# EAGLE design Microcontroller_board (EAGLE 5.11)
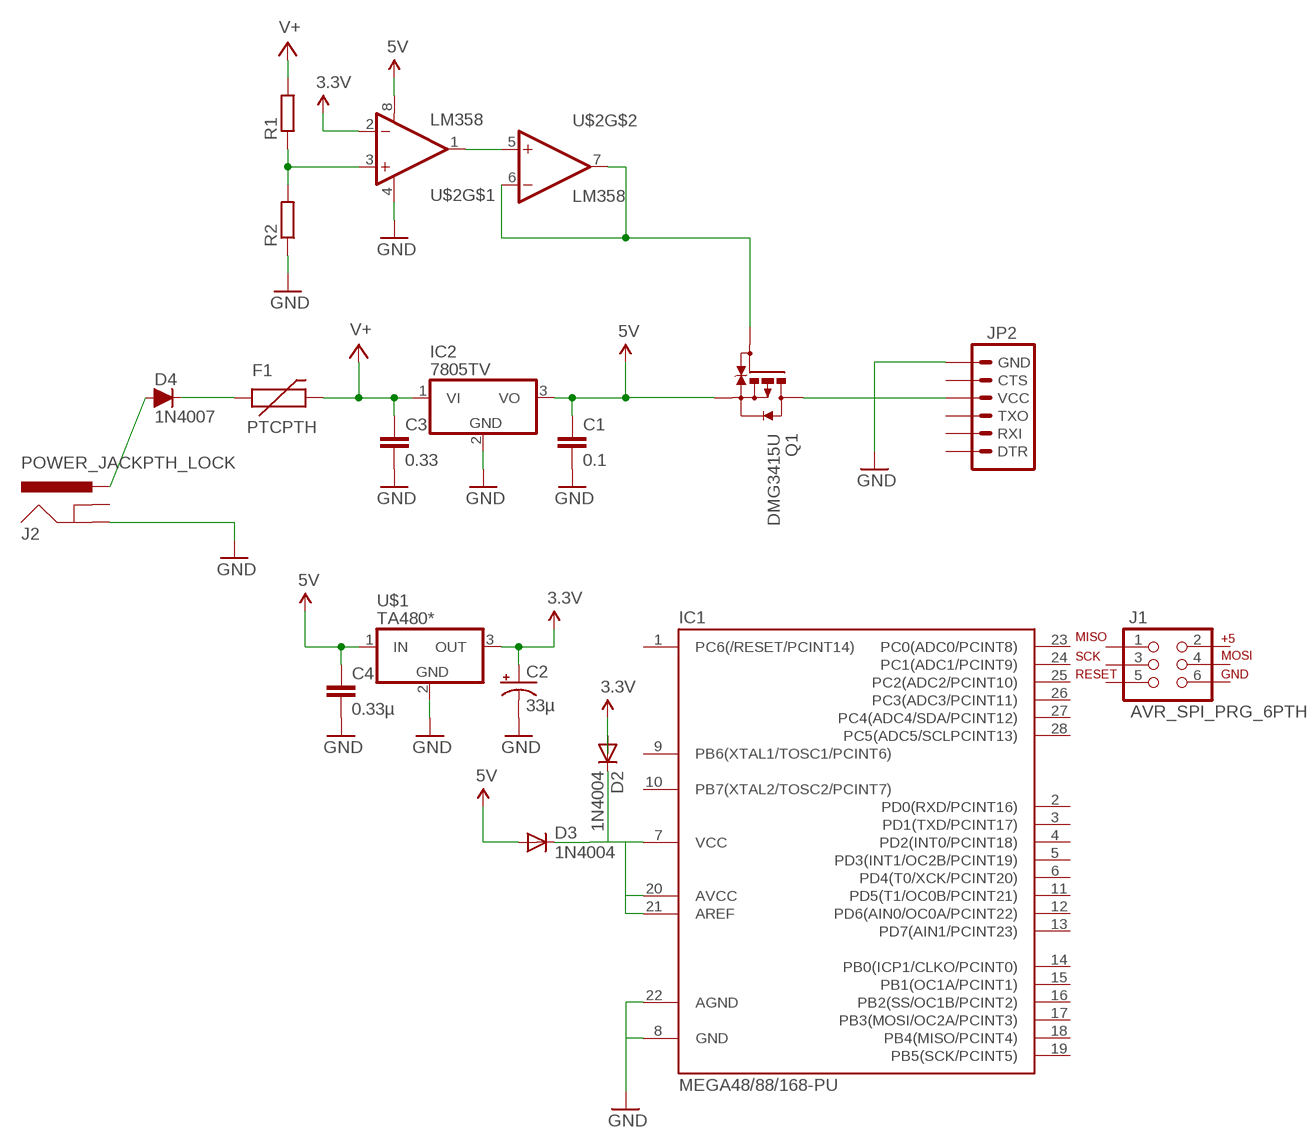
[diagram p0: schematic, sheet 1]

## Parts
C1  0.1  CAPPTH  [CAP-PTH-SMALL]
C2  33µ  CAP_POLC  [PANASONIC_C]
C3  0.33  CAPPTH  [CAP-PTH-SMALL]
C4  0.33µ  CAPPTH  [CAP-PTH-SMALL]
D2  1N4004  [DO41-10]
D3  1N4004  [DO41-10]
D4  1N4007  [DO41-10]
F1  PTCPTH  [PTC]
IC1  MEGA48/88/168-PU  [DIL28-3]
IC2  7805TV  [TO220V]
J1  AVR_SPI_PRG_6PTH  [2X3]
J2  POWER_JACKPTH_LOCK  [POWER_JACK_PTH_LOCK]
JP2  ARDUINO_SERIAL_PROGRAMPTH  [1X06]
Q1  DMG3415U  [SOT23]
R1  R-EU_0204/5  [0204/5]
R2  R-EU_0204/5  [0204/5]
U$1  TA480*  TA4800  [TOSHIBA-HSIP3-2.30B]
U$2  LM358  [DIP08]

## Nets
3.3V: C2.+ D2.A U$1.3(OUT) U$2.2(-IN)
5V: C1.1 C4.1 D3.A IC2.3(VO) Q1.2(S) U$1.1(IN) U$2.8(V+)
GND: C1.2 C2.- C3.2 C4.2 IC1.8(GND) IC1.22(AGND) IC2.2(GND) J2.GND JP2.6(GND) R2.1 U$1.2(GND) U$2.4(V-)
N$1: R1.1 R2.2 U$2.3(+IN)
N$2: D4.A J2.PWR
N$3: D2.C D3.C IC1.7(VCC) IC1.20(AVCC) IC1.21(AREF)
N$5: D4.C F1.P$1
N$6: JP2.4(VCC) Q1.3(D)
N$7: U$2.1(OUT) U$2.5(+IN)
N$8: Q1.1(G) U$2.6(-IN) U$2.7(OUT)
V+: C3.1 F1.P$2 IC2.1(VI) R1.2
Unconnected: IC1.1(PC6(/RESET/PCINT14)) IC1.2(PD0(RXD/PCINT16)) IC1.3(PD1(TXD/PCINT17)) IC1.4(PD2(INT0/PCINT18)) IC1.5(PD3(INT1/OC2B/PCINT19)) IC1.6(PD4(T0/XCK/PCINT20)) IC1.9(PB6(XTAL1/TOSC1/PCINT6)) IC1.10(PB7(XTAL2/TOSC2/PCINT7)) IC1.11(PD5(T1/OC0B/PCINT21)) IC1.12(PD6(AIN0/OC0A/PCINT22)) IC1.13(PD7(AIN1/PCINT23)) IC1.14(PB0(ICP1/CLKO/PCINT0)) IC1.15(PB1(OC1A/PCINT1)) IC1.16(PB2(SS/OC1B/PCINT2)) IC1.17(PB3(MOSI/OC2A/PCINT3)) IC1.18(PB4(MISO/PCINT4)) IC1.19(PB5(SCK/PCINT5)) IC1.23(PC0(ADC0/PCINT8)) IC1.24(PC1(ADC1/PCINT9)) IC1.25(PC2(ADC2/PCINT10)) IC1.26(PC3(ADC3/PCINT11)) IC1.27(PC4(ADC4/SDA/PCINT12)) IC1.28(PC5(ADC5/SCLPCINT13)) J1.1 J1.2 J1.3 J1.4 J1.5 J1.6 J2.GNDBREAK JP2.1(DTR) JP2.2(RXI) JP2.3(TXO) JP2.5(CTS)

## Library data of the parts
C1 C3 C4 = SparkFun:CAP: Capacitor Standard 0603 ceramic capacitor, and 0.1" leaded capacitor.
C2 = SparkFun:CAP_POL: Capacitor Polarized These are standard SMD and PTH capacitors. Normally 10uF, 47uF, and 100uF in electrolytic and tantalum varieties. Always verify the external diameter of the through hole cap, it varies with capacity, voltage, and manufacturer. The EIA devices should be standard.
D2 D3 = diode:1N4004: DIODE general purpose rectifier, 1 A
D4 = JPN:1N4007: DIODE general purpose rectifier, 1 A
F1 = SparkFun:PTC: Resettable Fuse PTC Resettable Fuse. Spark Fun Electronics SKU : COM-08357
IC1 = avr-7:MEGA48/88/168-PU
IC2 = linear:78*: Positive VOLTAGE REGULATOR Source: http://cache.national.com/ds/LM/LM78L05.pdf http://www.fairchildsemi.com/ds/LM/LM7805.pdf
J1 = SparkFun:AVR_SPI_PRG_6: AVR ISP 6 Pin This is the reduced ISP connector for AVR programming. Common on Arduino. This footprint will take up less PCB space and can be used with a 10-pin to 6-pin adapter such as SKU: BOB-08508
J2 = SparkFun:POWER_JACK: Power Jack This is the standard 5.5mm barrel jack for power. The PTH is the most common, proven, reliable, footprint. All others are experimental. The Slot footprint only works if the mill layer is transmitted to the PCB fab house so be warned. Spark Fun Electronics SKU : PRT-00119. Mating wall wart : TOL-00298 (and others)
JP2 = SparkFun:ARDUINO_SERIAL_PROGRAM
Q1 = My Library:DMG3415
R1 R2 = resistor:R-EU_: RESISTOR, European symbol
U$1 = JPN:TA48**; 15F: 1.5V; 33F: 3.3V; 5F: 5V
U$2 = SparkFun:LM358

## Board
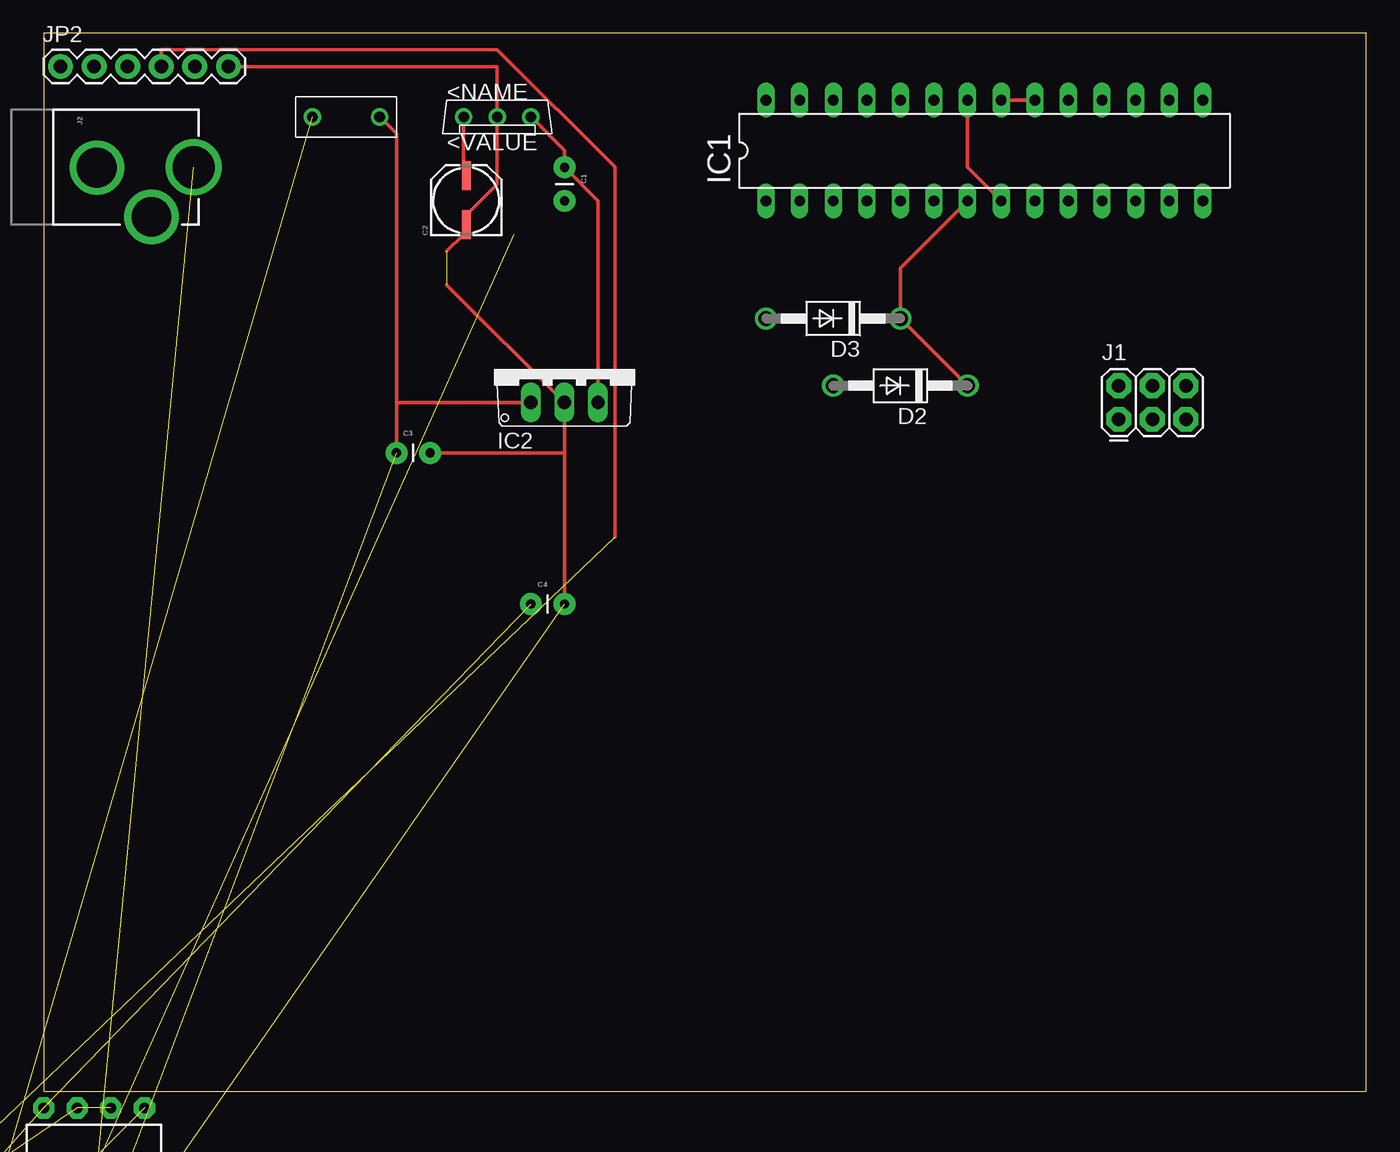
[diagram p1: board, top side]
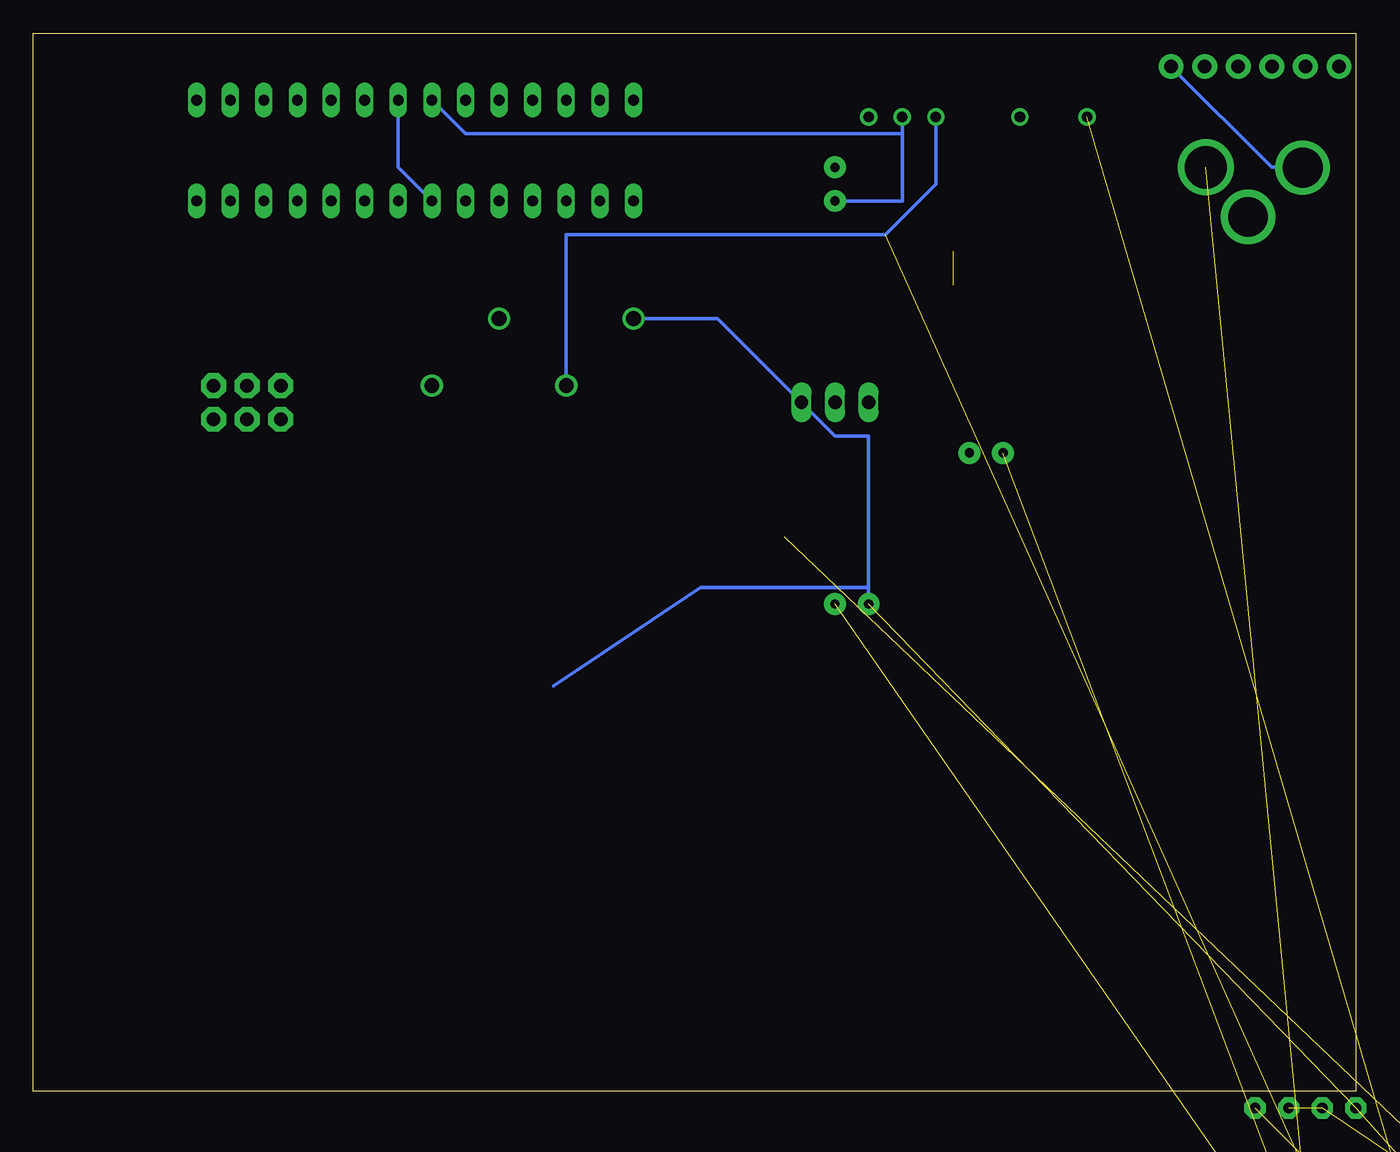
[diagram p2: board, bottom side, seen from below]

Size 100 x 80 mm. Coordinates in mm from the lower left corner, seen from the top.
Outline: 0,0 100,0 100,80 0,80 0,0
Copper layers (1*16): Top 0.035mm / dielectric 1.5mm / Bottom 0.035mm
Design rules "default": minimum track width 10mil, minimum drill 24mil, track to track 8mil, track to pad 8mil, pad to pad 8mil, via to via 8mil, smd to smd 8mil, copper to edge 40mil, drill to drill 8mil, minimum pad ring 10mil, minimum via ring 8mil, stop-mask expansion 4mil, vias tented up to drill 0mil, thermal gap 10mil

### Footprints (pad centres in the part's own frame; a part is rotated, then mirrored left to right if it is on the bottom)
CAP-PTH-SMALL = drill 0.7 pad 1.651 round: 1 0,0; 2 2.54,0
PANASONIC_C = smd 2.2 x 0.65: + 1.9,-0.2; - -1.8,-0.2
DO41-10 = drill 1.118 round: A 5.08,0; C -5.08,0
PTC = drill 0.8 round: P$1 -2.54,0; P$2 2.54,0
DIL28-3 = drill 0.813 long: 1 -16.51,-3.81; 2 -13.97,-3.81; 3 -11.43,-3.81; 4 -8.89,-3.81; 5 -6.35,-3.81; 6 -3.81,-3.81; 7 -1.27,-3.81; 8 1.27,-3.81; 9 3.81,-3.81; 10 6.35,-3.81; 11 8.89,-3.81; 12 11.43,-3.81; 13 13.97,-3.81; 14 16.51,-3.81; 15 16.51,3.81; 16 13.97,3.81; 17 11.43,3.81; 18 8.89,3.81; 19 6.35,3.81; 20 3.81,3.81; 21 1.27,3.81; 22 -1.27,3.81; 23 -3.81,3.81; 24 -6.35,3.81; 25 -8.89,3.81; 26 -11.43,3.81; 27 -13.97,3.81; 28 -16.51,3.81
TO220V = drill 1.016 long: 1 -2.54,-2.54; 2 0,-2.54; 3 2.54,-2.54
2X3 = drill 1.016 pad 1.88 octagon: 1 0,0; 2 0,2.54; 3 2.54,0; 4 2.54,2.54; 5 5.08,0; 6 5.08,2.54
POWER_JACK_PTH_LOCK = drill 2.997 pad 4.115 round: GND 0.025,6.557; GNDBREAK 3.762,10.7 | drill 3.2 pad 4.115 round: PWR 0,13.878
1X06 = drill 1.016 pad 1.88 round: 1 0,0; 2 2.54,0; 3 5.08,0; 4 7.62,0; 5 10.16,0; 6 12.7,0
SOT23 = smd 1 x 1.4: 1 -0.95,-1.1; 2 0.95,-1.1; 3 0,1.1
0204/5 = drill 0.813 octagon: 1 -2.54,0; 2 2.54,0
TOSHIBA-HSIP3-2.30B = drill 0.8 round: 1 2.54,0; 2 0,0; 3 -2.54,0
DIP08 = drill 0.813 pad 1.6 octagon: 1 -3.81,-3.81; 2 -1.27,-3.81; 3 1.27,-3.81; 4 3.81,-3.81; 5 3.81,3.81; 6 1.27,3.81; 7 -1.27,3.81; 8 -3.81,3.81

### Placement (x,y rotation side)
C1  39.37,69.85 270 top
C2  31.75,67.31 90 top
C3  26.67,48.26 0 top
C4  36.83,36.83 0 top
D2  64.77,53.34 180 top
D3  59.69,58.42 180 top
D4  -2.54,-21.59 0 top  (outside the outline)
F1  22.86,73.66 0 top
IC1  71.12,71.12 0 top
IC2  39.37,54.61 0 top
J1  81.28,50.8 0 top
J2  -2.54,69.85 270 top
JP2  1.27,77.47 0 top
Q1  -7.62,-7.62 0 top  (outside the outline)
R1  -5.08,-29.21 0 top  (outside the outline)
R2  -5.08,-34.29 0 top  (outside the outline)
U$1  34.29,73.66 0 top
U$2  3.81,-5.08 0 top

### Tracks (layer width: path | path; a pad name or v marks a point on that pad's centre or on a via)
3.3V  (1 unrouted)
  Top 0.254: U$1.3 31.75,69.85 C2.+
  Bottom 0.254: D2.A 59.69,64.77 35.56,64.77 31.75,68.58 U$1.3
5V  (2 unrouted)
  Top 0.254: U$1.1 39.37,71.12 C1.1 41.91,67.31 IC2.3
  Bottom 0.254: D3.A 48.26,58.42 IC2.3 39.37,49.53 36.83,49.53 36.83,38.1 | C4.1 36.83,38.1 | 60.64,30.65 49.53,38.1 36.83,38.1
GND  (3 unrouted)
  Top 0.254: 30.48,63.5 31.75,64.77 C2.- 31.75,66.04 34.29,68.58 U$1.2 34.29,77.47 JP2.6 | 30.48,60.96 IC2.2 39.37,48.26 | C4.2 39.37,48.26 | 39.37,48.26 C3.2 | IC1.8 69.85,69.85 IC1.22
  Bottom 0.254: JP2.6 6.35,69.85 5.08,69.85 J2.GND | 34.29,72.39 34.29,67.31 C1.2 | U$1.2 34.29,72.39 | IC1.22 67.31,72.39 34.29,72.39
N$1  (2 unrouted)
N$2  (1 unrouted)
N$3
  Top 0.254: IC1.21 IC1.20 | IC1.7 64.77,62.23 D3.C D2.C
  Bottom 0.254: IC1.21 72.39,69.85 IC1.7
N$5  (1 unrouted)
N$6  (1 unrouted)
  Top 0.254: 43.18,41.91 43.18,69.85 34.29,78.74 8.89,78.74 JP2.4
N$7  (1 unrouted)
N$8  (2 unrouted)
V+  (1 unrouted)
  Top 0.254: F1.P$2 26.67,72.39 26.67,52.07 | C3.1 26.67,52.07 | 26.67,52.07 IC2.1